# Altium schematic sheet Sheet2.SchDoc
size A4
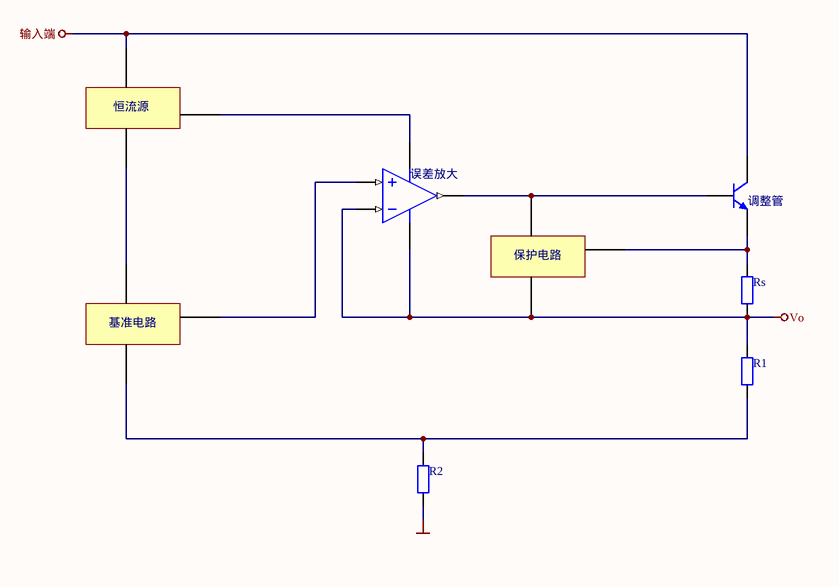
[diagram p0: Sheet2.SchDoc]

## Parts
(Parts that share a designator on the sheet are numbered #1, #2 ... from top to bottom, then left to right.)
*#1  Component_1  (value not drawn)
*#2  Component_3  (value not drawn)
*#3  Component_2  (value not drawn)
Q?  NPN  [TO-226-AA]  (value not drawn)
R1  Res2  [AXIAL-0.4]  (value not drawn)
R2  Res2  [AXIAL-0.4]  (value not drawn)
Rs  Res2  [AXIAL-0.4]  (value not drawn)
U?  LM124AJ  [J14A]  (value not drawn)  (part A of 4)

## Nets
GND: R2.1
Vo: *#2.15 R1.2 Rs.1 U?.2(IN1-) U?.4(V+)
输入端: *#1.10 Q?.1(C)
Net*#1_11: *#1.11 *#3.13
Net*#1_12: *#1.12 U?.11(GND)
Net*#2_14: *#2.14 Q?.2(B) U?.1(OUT1)
Net*#2_16: *#2.16 Q?.3(E) Rs.2
Net*#3_12: *#3.12 R1.1 R2.2
Net*#3_14: *#3.14 U?.3(IN1+)

## Notes on the sheet
- (near U?) 误差放大
- (near Q?) 调整管
- (in symbol Component_1) 恒流源
- (in symbol Component_2) 基准电路
- (in symbol Component_3) 保护电路

## Library data of the parts
Q? = NPN: NPN Bipolar Transistor; Published: 8-Jun-2000; LatestRevisionDate: 17-Jul-2002; LatestRevisionNote: Re-released for DXP Platform.; PackageReference: TO-226-AA; Publisher: Altium Limited; PackageDescription: TO, Flat Index; 3 In-Line, Axial Leads; Body Dia. 4.8mm; Leads 0.55 x 0.51 mm (max); Code_JEDEC: TO-226-AA
R1 R2 Rs = Res2: Resistor; Value: 1K; Published: 8-Jun-2000; LatestRevisionDate: 17-Jul-2002; LatestRevisionNote: Re-released for DXP Platform.; PackageReference: AXIAL-0.4; Publisher: Altium Limited; PackageDescription: Axial Device, Thru-Hole; 2 Leads; 0.4 in Pin Spacing
U? = LM124AJ: Low Power Quad Operational Amplifier, 14-pin CerDIP; Manufacturer: National Semiconductor; PackageTopMarking: NSUZXYYTT*LM124AJ; PowerWise: N; CompType: Amplifiers; High-Reliability: Y; Published: 4-Dec-2008; LatestRevisionDate: 13-Jan-2009; LatestRevisionNote: Sim Model Added.; DatasheetVersion: Aug-2000; PackageVersion: revJ, Jul-2002; PackageReference: J14A; Publisher: Altium Limited; PackageDescription: Cerdip, .400 x .310in Body, 14 Lead, .300in Centers, .100in Pitch; Supplier 1: Digi-Key; Supplier Part Number 1: LM124AJ-ND; Supplier 2: Farnell; Supplier Part Number 2: 1416362; PartNumber: LM124AJ; RoHS: N; PinCount: 14; ComponentLink1Description: LM124A Datasheet; ComponentLink1URL: http://www.national.com/ds/LM/LM124.pdf; ComponentLink2Description: LM124A Web Page; ComponentLink2URL: http://www.national.com/pf/LM/LM124A.html; ComponentLink3Description: J14A Package Page; ComponentLink3URL: http://www.national.com/packaging/folders/j14a.html